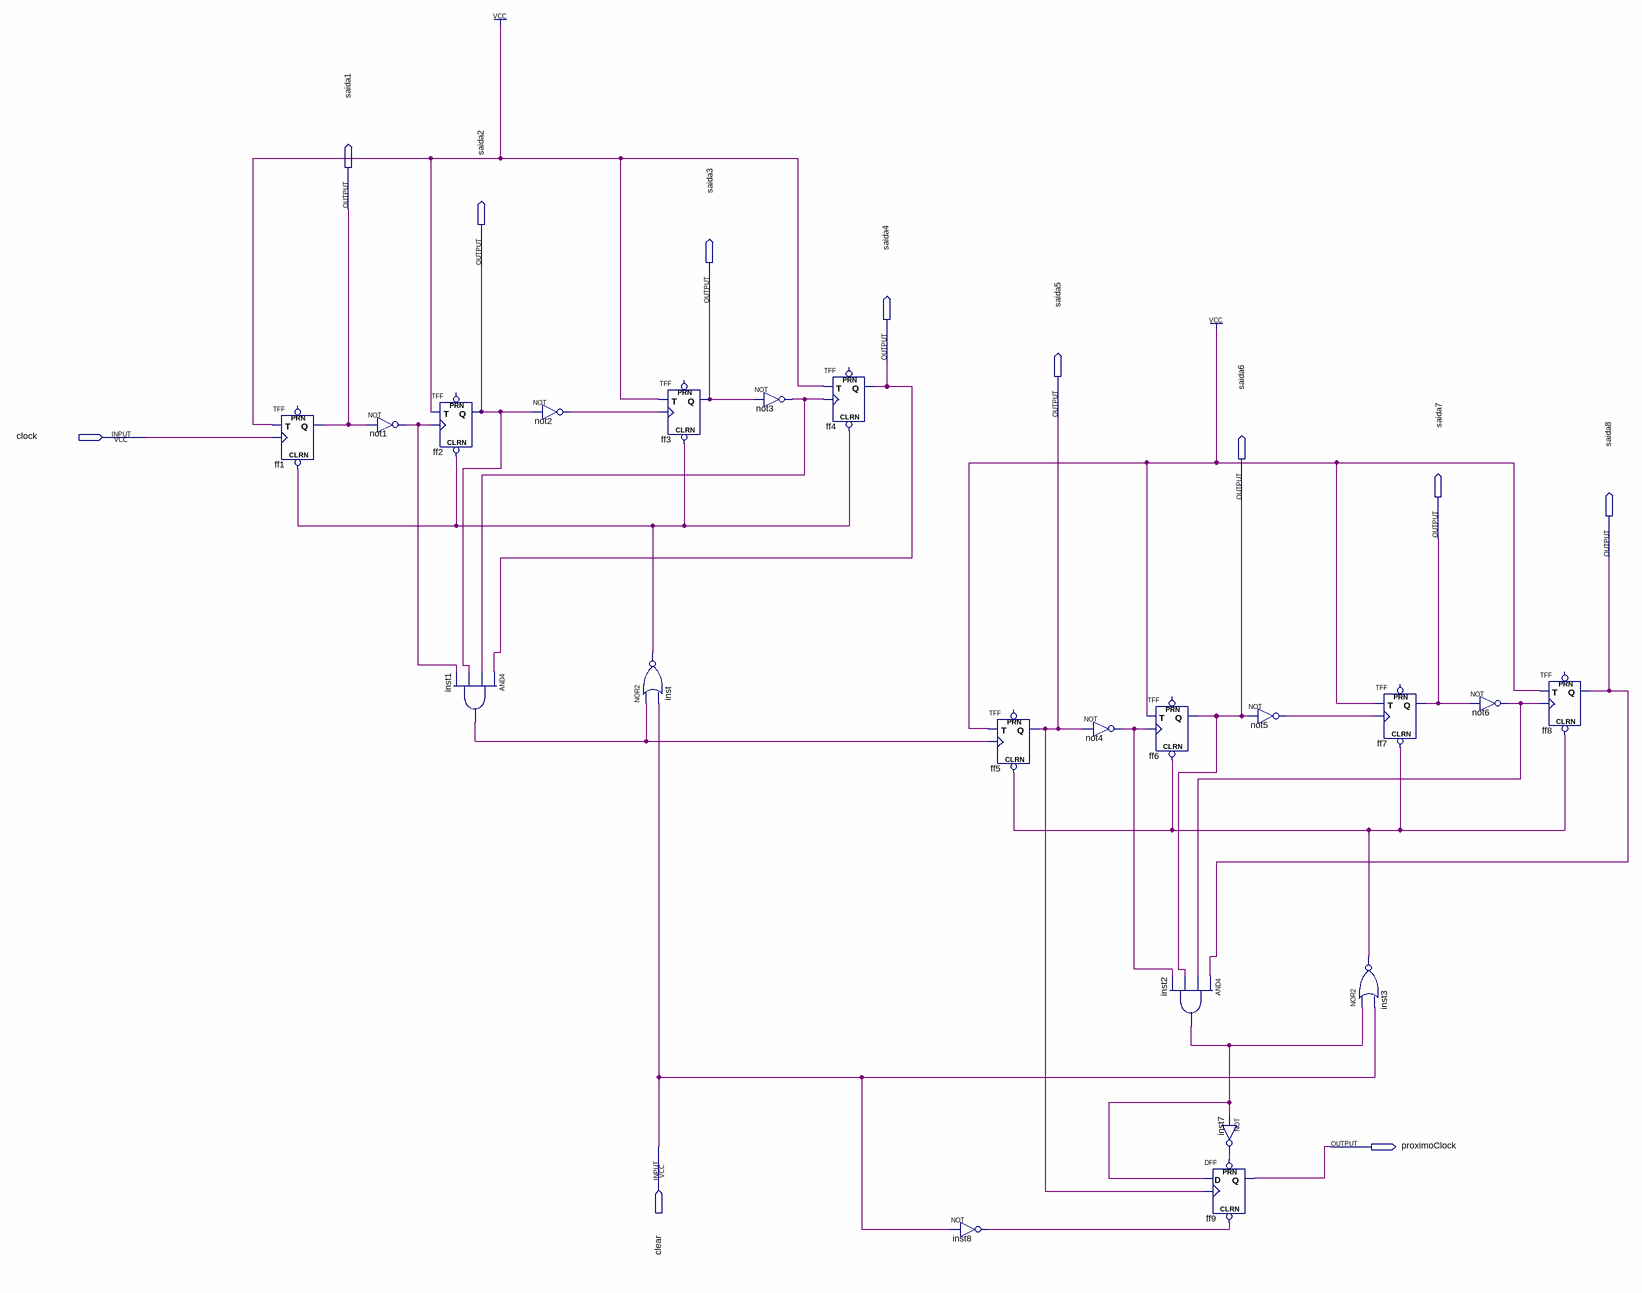
[diagram p0: schematic sheet]
// Quartus schematic ContadorSimples0a100.bdf as structural Verilog: 21 symbols, 11 pins
module ContadorSimples0a100 (
  input  clock,
  input  clear,
  output saida1,
  output saida2,
  output saida3,
  output saida4,
  output saida5,
  output saida6,
  output saida7,
  output saida8,
  output proximoClock
);

  wire inst1_out, inst2_out, inst3_out, inst7_out, inst8_out, inst_out, not1_out, not2_out, not3_out,
       not4_out, not5_out, not6_out;

  TFF ff1 (.CLRN(inst_out), .T(1'b1), .CLK(clock), .Q(saida1));  // open: PRN
  not not1 (not1_out, saida1);
  TFF ff2 (.CLRN(inst_out), .T(1'b1), .CLK(not1_out), .Q(saida2));  // open: PRN
  and inst1 (inst1_out, saida4, not3_out, saida2, not1_out);
  not not2 (not2_out, saida2);
  TFF ff3 (.CLRN(inst_out), .T(1'b1), .CLK(not2_out), .Q(saida3));  // open: PRN
  nor inst (inst_out, inst1_out, clear);
  not not3 (not3_out, saida3);
  TFF ff4 (.CLRN(inst_out), .T(1'b1), .CLK(not3_out), .Q(saida4));  // open: PRN
  not inst8 (inst8_out, clear);
  TFF ff5 (.CLRN(inst3_out), .T(1'b1), .CLK(inst1_out), .Q(saida5));  // open: PRN
  not not4 (not4_out, saida5);
  TFF ff6 (.CLRN(inst3_out), .T(1'b1), .CLK(not4_out), .Q(saida6));  // open: PRN
  and inst2 (inst2_out, saida8, not6_out, saida6, not4_out);
  not inst7 (inst7_out, inst2_out);
  DFF ff9 (.CLRN(inst8_out), .CLK(saida5), .D(inst2_out), .PRN(inst7_out), .Q(proximoClock));
  not not5 (not5_out, saida6);
  TFF ff7 (.CLRN(inst3_out), .T(1'b1), .CLK(not5_out), .Q(saida7));  // open: PRN
  nor inst3 (inst3_out, inst2_out, clear);
  not not6 (not6_out, saida7);
  TFF ff8 (.CLRN(inst3_out), .T(1'b1), .CLK(not6_out), .Q(saida8));  // open: PRN
endmodule
